# EAGLE design current_sense (EAGLE 6.3)
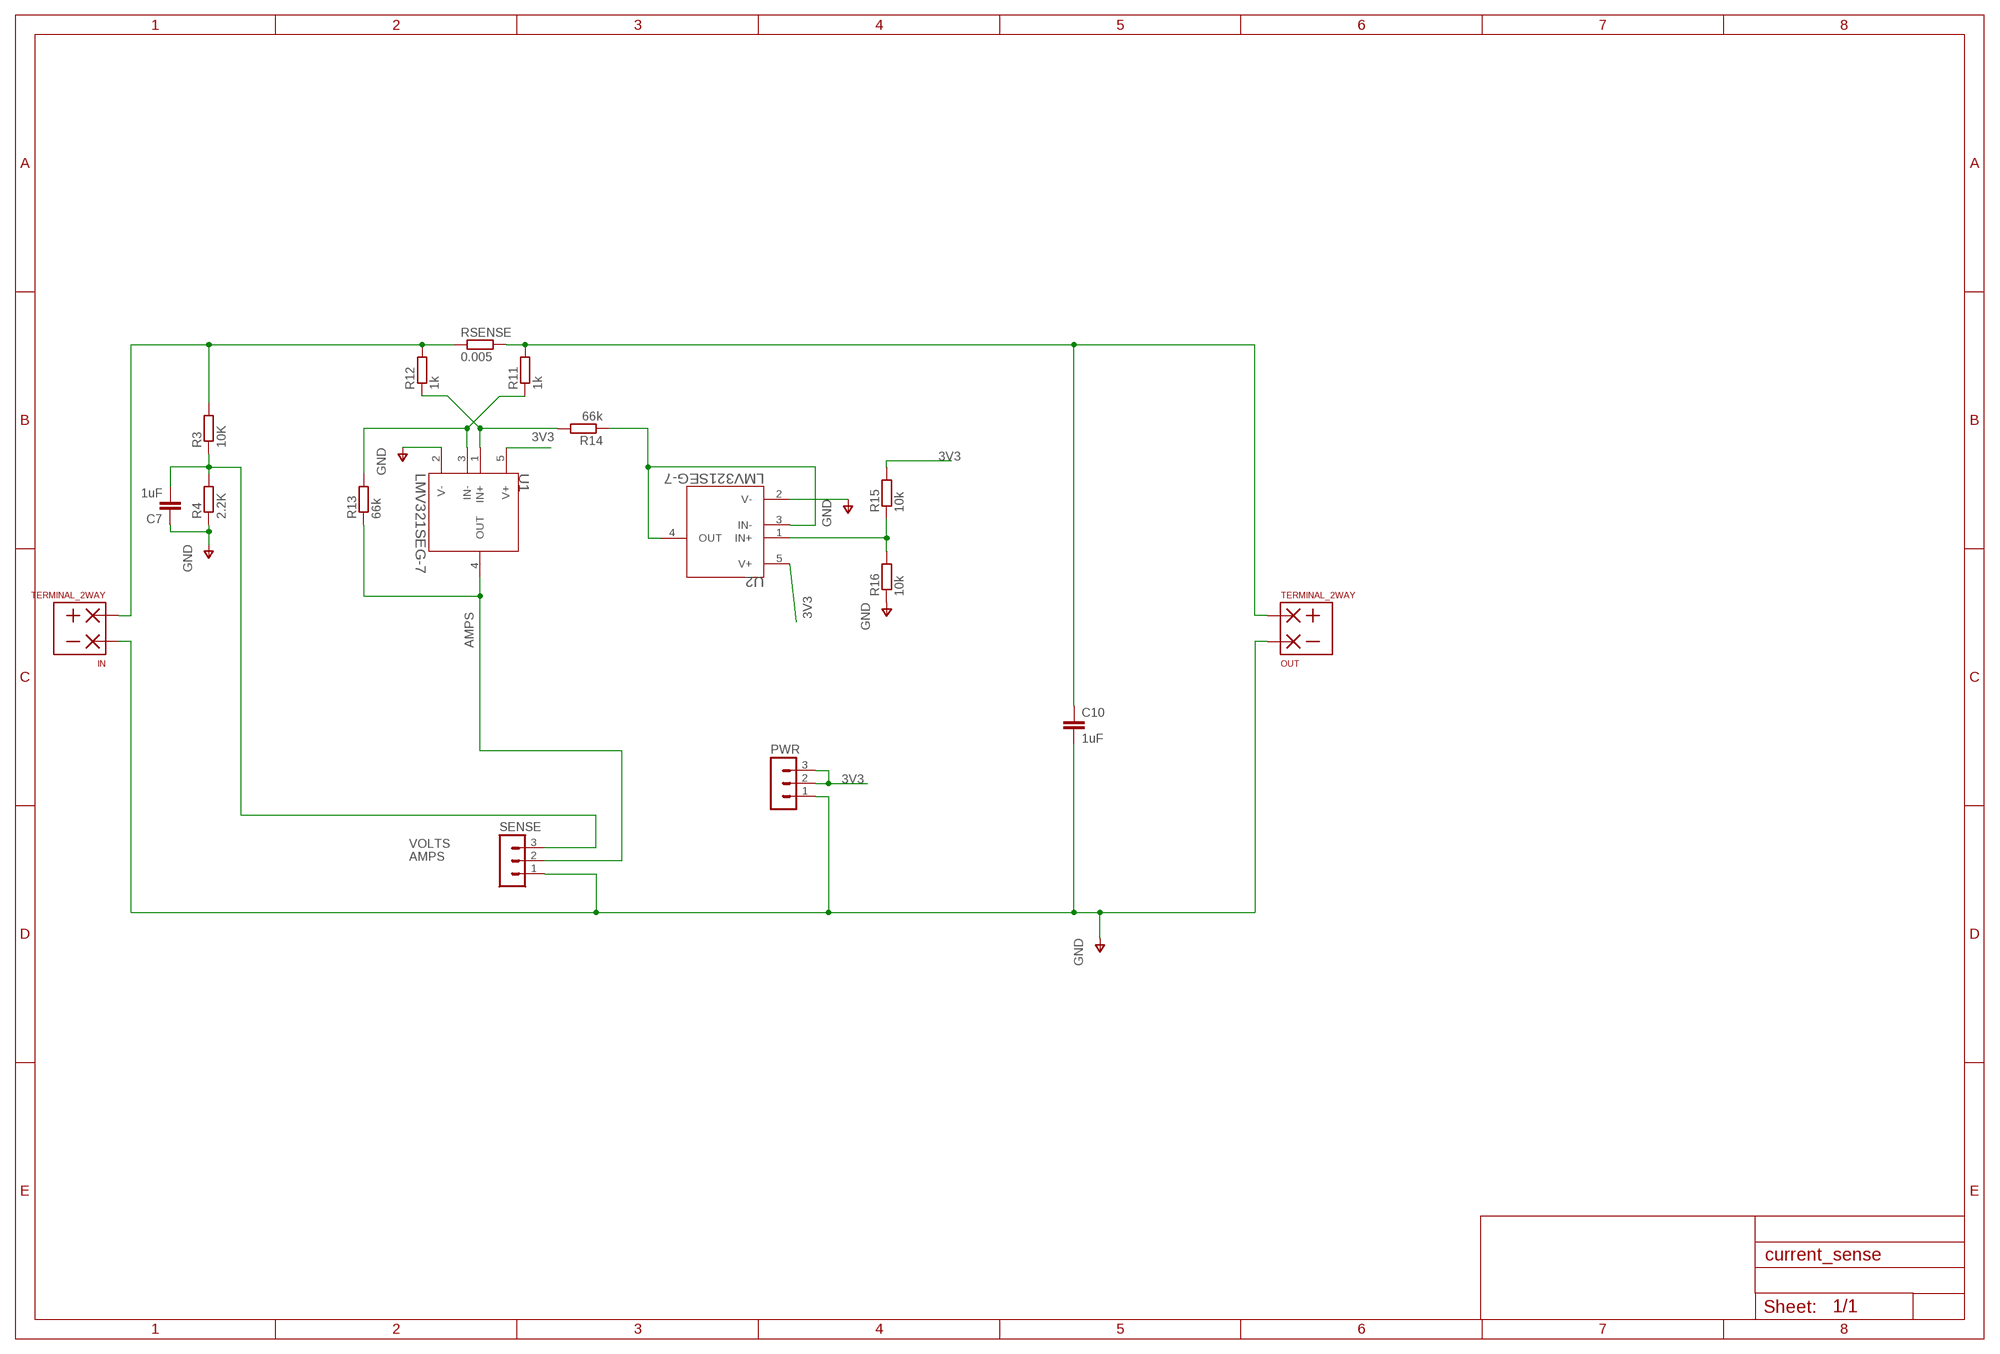
[diagram p0: schematic, sheet 1]

## Parts
C7  1uF  C2.5/2  [C2.5-2]
C10  1uF  C2.5/2  [C2.5-2]
IN  TERMINAL_2WAY  [TERMINAL_2WAY]
OUT  TERMINAL_2WAY  [TERMINAL_2WAY]
PWR  MA03-1  [MA03-1]
R3  10K  R-EU_M0805  [M0805]
R4  2.2K  R-EU_M0805  [M0805]
R11  1k  R-EU_M0805  [M0805]
R12  1k  R-EU_M0805  [M0805]
R13  66k  R-EU_M0805  [M0805]
R14  66k  R-EU_M0805  [M0805]
R15  10k  R-EU_M0805  [M0805]
R16  10k  R-EU_M0805  [M0805]
RSENSE  0.005  R-EU_R2512W  [R2512W]
SENSE  MA03-1  [MA03-1]
U1  LMV321SEG-7  [SOT65P210X110-5N]
U2  LMV321SEG-7  [SOT65P210X110-5N]

## Nets
3V3: PWR.2 PWR.3 R15.2 U1.5(V+) U2.5(V+)
AMPS: R13.1 SENSE.2 U1.4(OUT)
GND: C7.1 C10.2 IN.P$2 OUT.P$2 PWR.1 R4.1 R16.1 SENSE.1
N$1: R11.1 R13.2 U1.3(IN-)
N$3: R12.1 R14.2 U1.1(IN+)
N$9 [pwr]: C10.1 OUT.P$1 R11.2 RSENSE.2
N$16 [pwr]: IN.P$1 R3.2 R12.2 RSENSE.1
N$17: R15.1 R16.2 U2.1(IN+)
N$18: R14.1 U2.3(IN-) U2.4(OUT)
V-: U1.2(V-) U2.2(V-) ; supply symbol labelled GND
VOLTS: C7.2 R3.1 R4.2 SENSE.3

## Library data of the parts
C7 C10 = capacitor-wima:C: CAPACITOR naming: grid - package width
IN OUT = equinox:TERMINAL_2WAY
PWR SENSE = con-lstb:MA03-1: PIN HEADER
R3 R4 R11-R16 RSENSE = rcl:R-EU_: RESISTOR, European symbol
U1 U2 = lib:LMV321SEG-7: OPERATIONAL AMPLIFIERS; MPN: LMV321SEG-7; OC_FARNELL: 1904046; OC_NEWARK: 55T3175; PACKAGE: SOT353-5; SUPPLIER: DIODES INC.

## Net classes
0 default: width 0.381 mm, drill 0.61 mm, clearance 0.381 mm
1 pwr: width 0.762 mm, drill 0.61 mm, clearance 0.762 mm

## Board
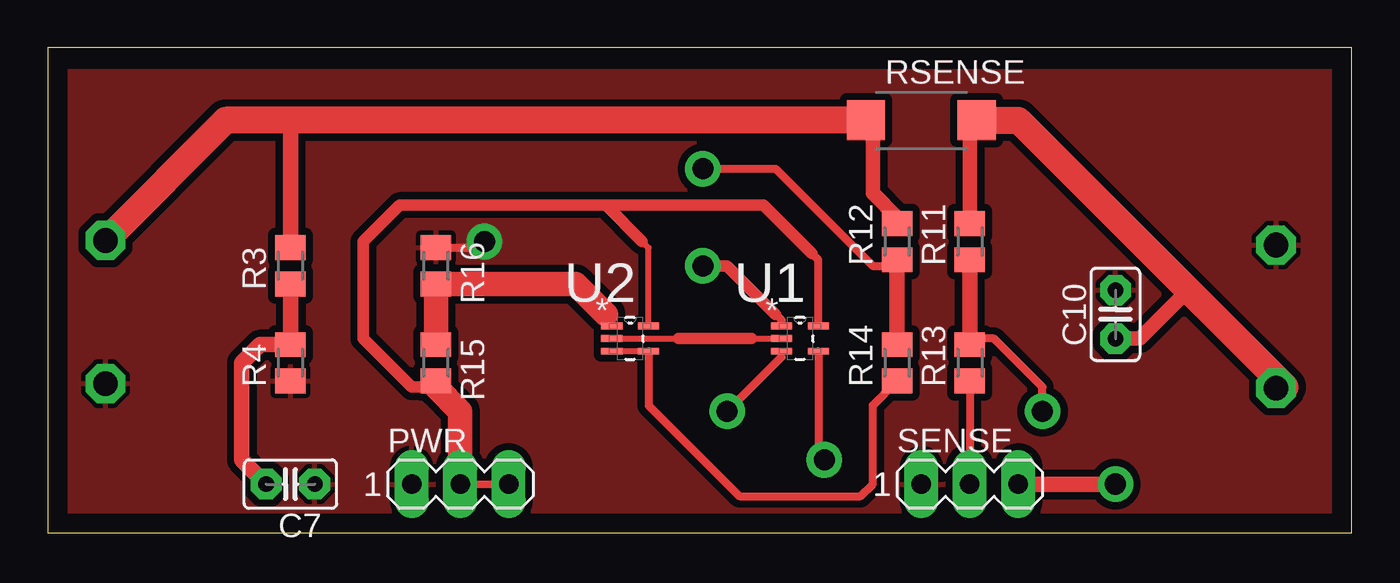
[diagram p1: board, top side]
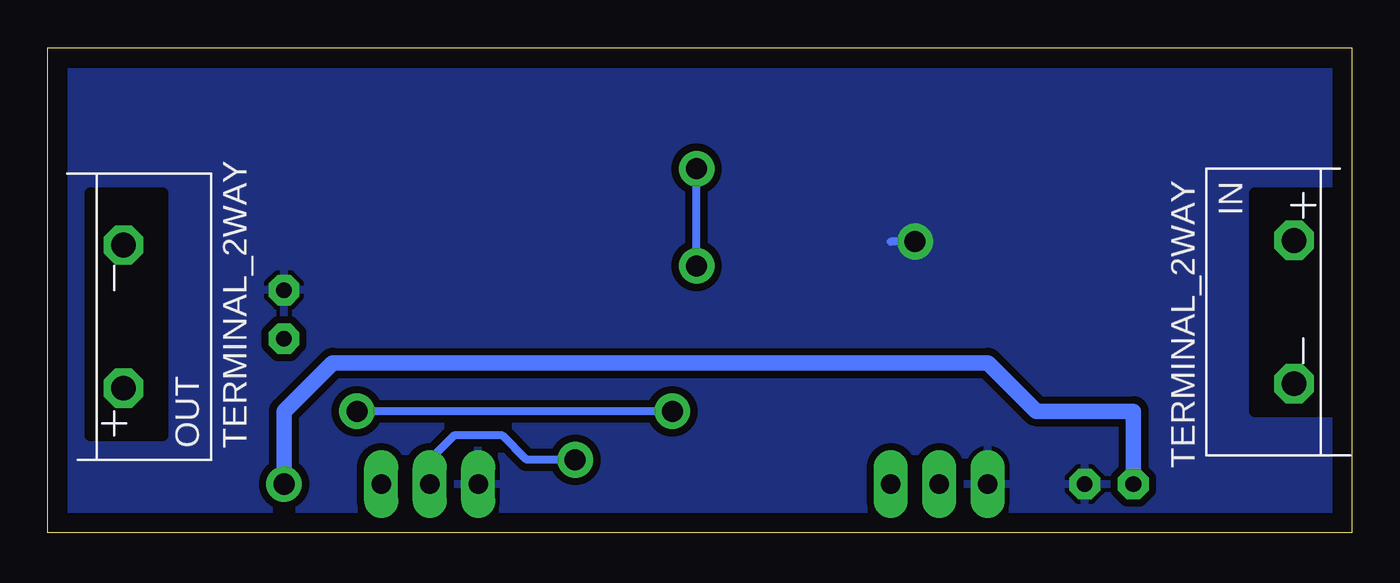
[diagram p2: board, bottom side, seen from below]

Size 68.25 x 25.39 mm. Coordinates in mm from the lower left corner, seen from the top.
Outline: 0,0 68.25,0 68.25,25.39 0,25.39 0,0
Copper layers (1*16): Top 0.0356mm / dielectric 1.5011mm / Bottom 0.0356mm
Design rules "ee_rules_10mil": minimum track width 10mil, minimum drill 24mil, track to track 10mil, track to pad 15mil, pad to pad 15mil, via to via 15mil, smd to smd 8mil, copper to edge 40mil, drill to drill 15mil, minimum pad ring 15mil, minimum via ring 15mil, stop-mask expansion 4mil, vias tented up to drill 0mil, thermal gap 10mil
bRestrict: area 1.3,6.3 to 5.1,17.8; area 62.2,5.1 to 66,17.8

### Footprints (pad centres in the part's own frame; a part is rotated, then mirrored left to right if it is on the bottom)
C2.5-2 = drill 0.813 pad 1.6 octagon: 1 -1.27,0; 2 1.27,0
TERMINAL_2WAY = drill 1.3 octagon: P$1 3.75,4.6; P$2 11.25,4.6
MA03-1 = drill 1.016 long: 1 -2.54,0; 2 0,0; 3 2.54,0
M0805 = smd 1.3 x 1.6: 1 -0.95,0; 2 0.95,0
R2512W = smd 2 x 2.1: 1 -2.896,0; 2 2.896,0
SOT65P210X110-5N = smd 1.118 x 0.356: 1 -0.965,0.66; 2 -0.965,0; 3 -0.965,-0.66; 4 0.965,-0.66; 5 0.965,0.66

### Placement (x,y rotation side)
C7  12.7,2.54 180 top
C10  55.88,11.43 90 top
IN  7.62,19.05 270 bottom
OUT  59.69,3.81 90 bottom
PWR  21.59,2.54 0 top
R3  12.7,13.97 90 top
R4  12.7,8.89 90 top
R11  48.26,15.24 90 top
R12  44.45,15.24 90 top
R13  48.26,8.89 90 top
R14  44.45,8.89 90 top
R15  20.32,8.89 270 top
R16  20.32,13.97 270 top
RSENSE  45.72,21.59 0 top
SENSE  48.26,2.54 0 top
U1  39.37,10.16 0 top
U2  30.48,10.16 0 top

### Tracks (layer width: path | path; a pad name or v marks a point on that pad's centre or on a via)
3V3
  Top 0.305: U2.5 31.45,14.91 31.11,15.24
  Top 0.381: PWR.2 PWR.3
  Top 0.406: U1.5 40.34,14.28 40.01,14.61
  Top 0.61: 31.11,15.24 29.21,17.14 | 29.21,17.14 18.41,17.14 16.51,15.24 16.51,10.16 19.05,7.62 20,7.62 R15.2 | 40.01,14.61 37.47,17.14 29.21,17.14
  Top 1.27: R15.2 20.32,7.62 21.59,6.35 PWR.2
AMPS  (via drill 1.1)
  Top 0.406: R13.1 SENSE.2 | U1.4 40.34,4.12 v40.64,3.81
  Bottom 0.406: v40.64,3.81 43.18,3.81 44.45,5.08 46.99,5.08 48.26,3.81 SENSE.2
GND  (via drill 1.1)
  Top 0.406: R16.1 22.86,14.92 v22.86,15.24
  Bottom 0.406: v22.86,15.24 24.13,15.24
  pour Top: 0,0 67.31,0 67.31,24.13 0,24.13
  pour Bottom: 0,0 67.31,0 67.31,24.13 0,24.13
N$1  (via drill 1.1)
  Top 0.254: U1.3 38.41,9.2
  Top 0.406: 38.41,9.2 v35.56,6.35 | v52.07,6.35 52.07,7.62 49.53,10.16 48.58,10.16 R13.2
  Top 0.813: R13.2 R11.1
  Bottom 0.406: v35.56,6.35 v52.07,6.35
N$3  (via drill 1.1)
  Top 0.406: v34.29,19.05 38.1,19.05 43.18,13.97 44.13,13.97 R12.1 | U1.1 38.41,11.12 38.1,11.43
  Top 0.61: 38.1,11.43 35.56,13.97 v34.29,13.97
  Top 0.813: R14.2 R12.1
  Bottom 0.406: v34.29,13.97 v34.29,19.05
N$9
  Top 0.762: R11.2 48.26,21.59 RSENSE.2 | 59.69,12.7 57.15,10.16 C10.1
  Top 1.422: RSENSE.2 50.8,21.59 59.69,12.7 64.77,7.62 64.35,7.62 OUT.P$1
N$16
  Top 0.762: R12.2 44.45,16.51 43.18,17.78 43.18,21.59 RSENSE.1
  Top 0.813: R3.2 12.7,21.59
  Top 1.422: RSENSE.1 12.7,21.59 9.31,21.59 IN.P$1
N$17
  Top 0.254: 29.21,11.43 29.21,11.12 U2.1
  Top 1.27: R15.1 R16.2 27.62,13.02 29.21,11.43
N$18
  Top 0.305: U2.3 U2.4
  Top 0.406: U2.4 31.45,6.66 36.2,1.91 42.55,1.91 43.18,2.54 43.18,6.67 R14.1
V-
  Top 0.305: U2.2 33.02,10.16 | 36.83,10.16 U1.2
  Top 0.61: 33.02,10.16 36.83,10.16
VOLTS  (via drill 1.1)
  Top 0.813: R3.1 R4.2 11.11,9.84 10.16,8.89 10.16,3.81 C7.2 | SENSE.3 v55.88,2.54
  Bottom 0.813: v55.88,2.54 55.88,6.35 53.34,8.89 19.05,8.89 16.51,6.35 11.43,6.35 C7.2